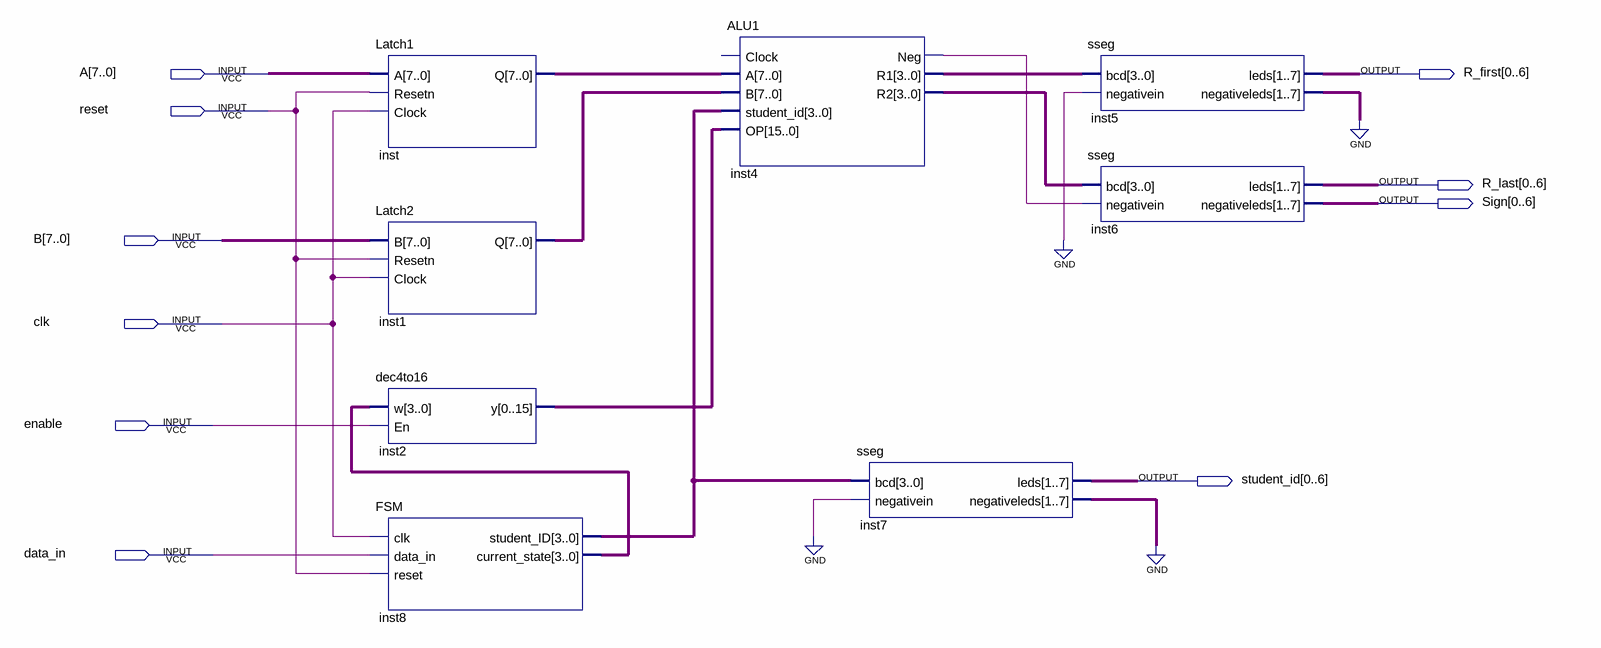
[diagram p0: schematic sheet]
// Quartus schematic Block.bdf as structural Verilog: 8 symbols, 10 pins
module Block (
  input  [7:0] A,
  input  reset,
  input  [7:0] B,
  input  clk,
  input  enable,
  input  data_in,
  output [0:6] R_first,
  output [0:6] R_last,
  output [0:6] Sign,
  output [0:6] student_id
);

  wire inst4_neg;
  wire [3:0] inst4_r1, inst4_r2, inst8_current_state, inst8_student_id;
  wire [6:0] inst5_negativeleds, inst7_negativeleds;
  wire [7:0] inst1_q, inst_q;
  wire [15:0] inst2_y;

  Latch1 inst (.A(A), .Resetn(reset), .Clock(clk), .Q(inst_q));
  Latch2 inst1 (.B(B), .Resetn(reset), .Clock(clk), .Q(inst1_q));
  dec4to16 inst2 (.w(inst8_current_state), .En(enable), .y(inst2_y));
  FSM inst8 (
    .clk(clk), .data_in(data_in), .reset(reset), .student_ID(inst8_student_id),
    .current_state(inst8_current_state));
  ALU1 inst4 (
    .A(inst_q), .B(inst1_q), .student_id(inst8_student_id), .OP(inst2_y), .Neg(inst4_neg), .R1(inst4_r1),
    .R2(inst4_r2));  // open: Clock
  sseg inst7 (.bcd(inst8_student_id), .negativein(1'b0), .leds(student_id), .negativeleds(inst7_negativeleds));
  sseg inst5 (.bcd(inst4_r1), .negativein(1'b0), .leds(R_first), .negativeleds(inst5_negativeleds));
  sseg inst6 (.bcd(inst4_r2), .negativein(inst4_neg), .leds(R_last), .negativeleds(Sign));
  // also tied to GND on the sheet: {inst7_negativeleds[0], inst7_negativeleds[1], inst7_negativeleds[2], inst7_negativeleds[3], inst7_negativeleds[4], inst7_negativeleds[5], inst7_negativeleds[6], inst5_negativeleds[0], inst5_negativeleds[1], inst5_negativeleds[2], inst5_negativeleds[3], inst5_negativeleds[4], inst5_negativeleds[5], inst5_negativeleds[6]}
endmodule
